# Altium schematic sheet Sheet2.SchDoc
size 420 x 297 mm; DocumentNumber: ЭАЕСН.464512.003Э3; SheetNumber: 2; SheetTotal: x; DocumentName: Sheet1.SCHDOC
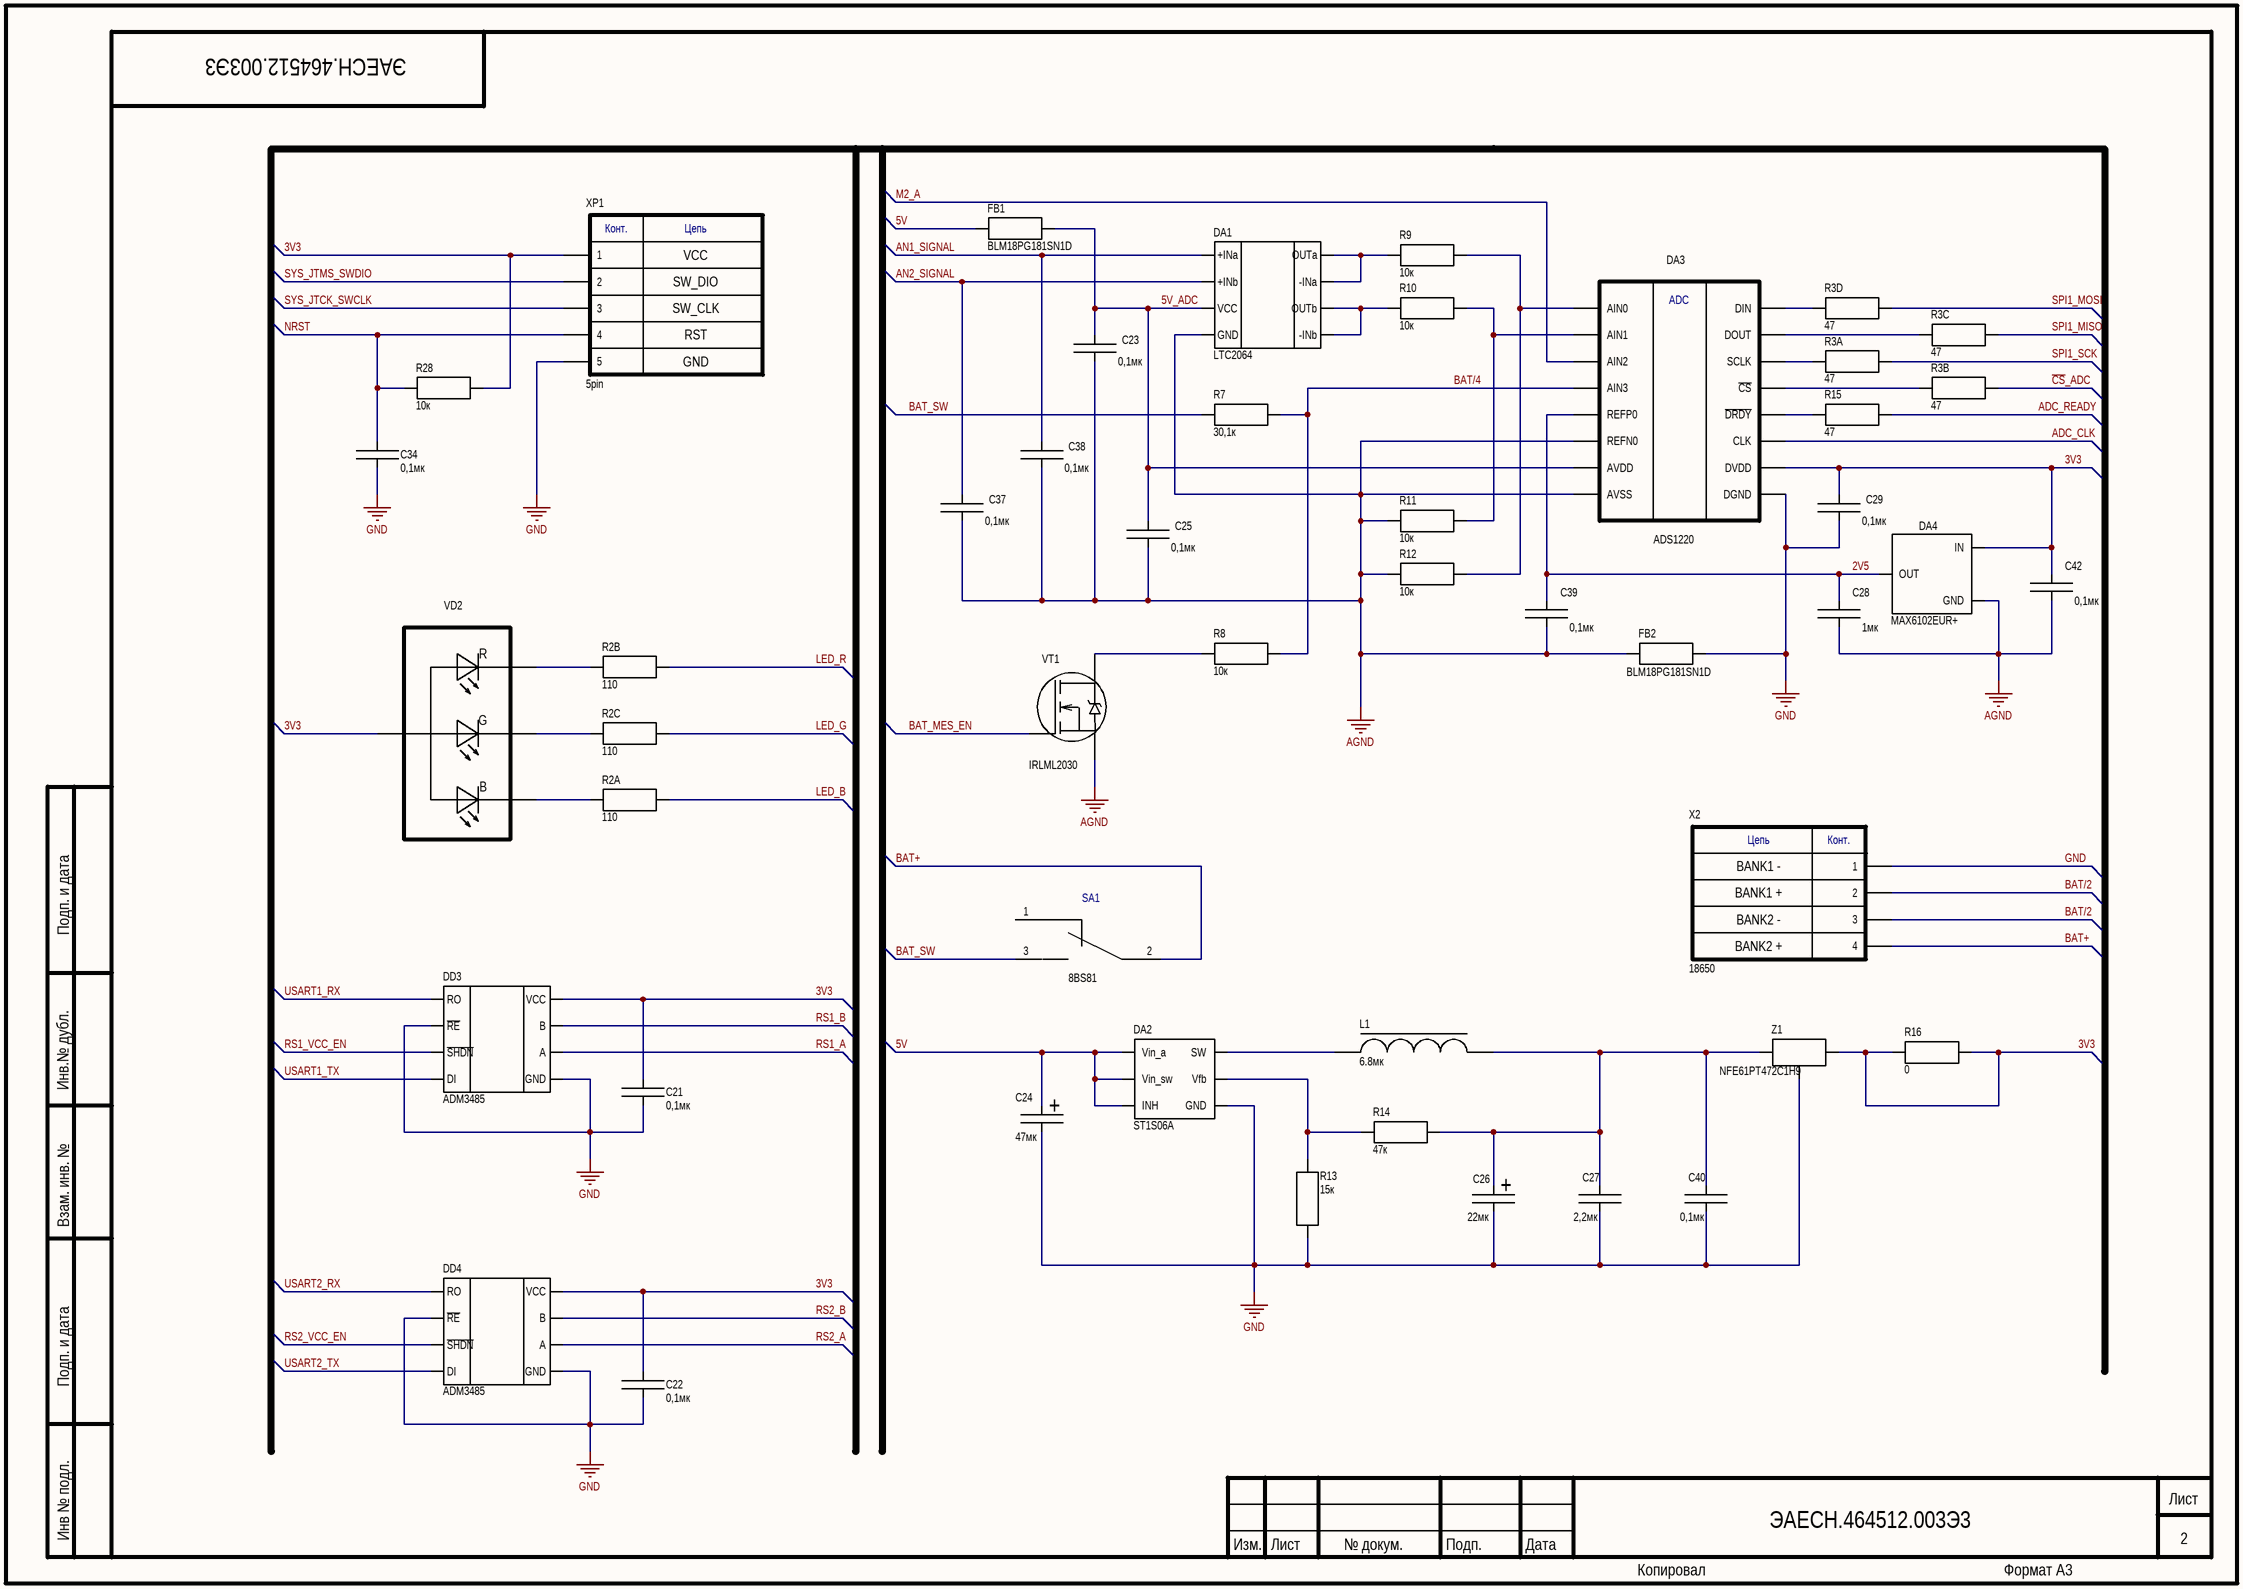
[diagram p0: Sheet2.SchDoc]

## Parts
C21  value 0,1мк  [С0603]  (hidden comment: C)
C22  value 0,1мк  [С0603]  (hidden comment: C)
C23  value 0,1мк  [С0603]  (hidden comment: C)
C24  value 47мк  [CASE B]  (hidden comment: C_el)
C25  value 0,1мк  [С0603]  (hidden comment: C)
C26  value 22мк  [Case A]  (hidden comment: C_el)
C27  value 2,2мк  [С0603]  (hidden comment: C)
C28  value 1мк  [С0603]  (hidden comment: C)
C29  value 0,1мк  [С0603]  (hidden comment: C)
C34  value 0,1мк  [С0603]  (hidden comment: C)
C37  value 0,1мк  [С0603]  (hidden comment: C)
C38  value 0,1мк  [С0603]  (hidden comment: C)
C39  value 0,1мк  [С0603]  (hidden comment: C)
C40  value 0,1мк  [С0603]  (hidden comment: C)
C42  value 0,1мк  [С0603]  (hidden comment: C)
DA1  LTC2064  [MSOP8]
DA2  ST1S06A  [DFN6]
DA3  ADS1220  [TSSOP-16]
DA4  MAX6102EUR+  [SOT-23]
DD3  ADM3485  [SOIC8]
DD4  ADM3485  [SOIC8]
FB1  BLM18PG181SN1D  [R0603]
FB2  BLM18PG181SN1D  [R0603]
L1  6.8мк  [Ind_6.5x6.5]
R2  value 110  [CAT16]  (hidden comment: RES_4)  (parts A,B,C of 4)
R3  value 47  [CAT16]  (hidden comment: RES_4)  (parts A,B,C,D of 4)
R7  value 30,1к  [R0603]  (hidden comment: R)
R8  value 10к  [R0603]  (hidden comment: R)
R9  value 10к  [R0603]  (hidden comment: R)
R10  value 10к  [R0603]  (hidden comment: R)
R11  value 10к  [R0603]  (hidden comment: R)
R12  value 10к  [R0603]  (hidden comment: R)
R13  value 15к  [R0603]  (hidden comment: R)
R14  value 47к  [R0603]  (hidden comment: R)
R15  value 47  [R0603]  (hidden comment: R)
R16  value 0  [R1206]  (hidden comment: R)
R28  value 10к  [R0603]  (hidden comment: R)
SA1  8BS81  [SMTS-102]
VD2  FYLS-3528RGBC  [LED_RGB]  (value not drawn)
VT1  IRLML2030  [SOT-23]
X2  18650  [18650_holder]
XP1  5pin  [PLS-5]
Z1  NFE61PT472C1H9  [NFE61P]

## Nets
AGND: C23.2 C25.2 C28.2 C37.2 C38.2 C39.2 C42.2 DA1.4(GND) DA3.5(AVSS) DA3.8(REFN0) DA4.3(GND) FB2.1 R11.2 R12.2 VT1.2(S)
GND: C21.2 C22.2 C24.2 C26.2 C27.2 C29.2 C34.2 C40.2 DA2.2(GND) DA3.4(DGND) DD3.2(~{RE}) DD3.5(GND) DD4.2(~{RE}) DD4.5(GND) FB2.2 R13.1 X2.1 XP1.5 Z1.3(GND)
2V5: C28.1 C39.1 DA3.9(REFP0) DA4.2(OUT)
3V3: C21.1 C22.1 C29.1 C42.1 DA3.13(DVDD) DA4.1(IN) DD3.8(VCC) DD4.8(VCC) R16.1 R16.2 R28.2 VD2.2 XP1.1 Z1.2
5V: C24.1 DA2.4(Vin_sw) DA2.5(Vin_a) DA2.6(INH) FB1.2
5V_ADC: C23.1 C25.1 DA1.8(VCC) DA3.12(AVDD) FB1.1
ADC_CLK: DA3.3(CLK)
ADC_READY: R15.2
AN1_SIGNAL: C38.1 DA1.3(+INa)
AN2_SIGNAL: C37.1 DA1.5(+INb)
BAT+: SA1.2 X2.4
BAT/2: X2.2 X2.3
BAT/4: DA3.6(AIN3) R7.2 R8.2
BAT_MES_EN: VT1.1(G)
BAT_SW: R7.1 SA1.3
~{CS}_ADC: R3.7
LED_B: R2.8
LED_G: R2.6
LED_R: R2.7
M2_A: DA3.7(AIN2)
NRST: C34.1 R28.1 XP1.4
RS1_A: DD3.6(A)
RS1_B: DD3.7(B)
RS1_VCC_EN: DD3.3(~{SHDN})
RS2_A: DD4.6(A)
RS2_B: DD4.7(B)
RS2_VCC_EN: DD4.3(~{SHDN})
SPI1_MISO: R3.6
SPI1_MOSI: R3.5
SPI1_SCK: R3.8
SYS_JTCK_SWCLK: XP1.3
SYS_JTMS_SWDIO: XP1.2
USART1_RX: DD3.1(RO)
USART1_TX: DD3.4(DI)
USART2_RX: DD4.1(RO)
USART2_TX: DD4.4(DI)
NetC26_1: C26.1 C27.1 C40.1 L1.1 R14.2 Z1.1
NetDA1_1: DA1.1(OUTa) DA1.2(-INa) R9.1
NetDA1_6: DA1.6(-INb) DA1.7(OUTb) R10.1
NetDA2_1: DA2.1(Vfb) R13.2 R14.1
NetDA2_3: DA2.3(SW) L1.2
NetDA3_1: DA3.1(SCLK) R3.1
NetDA3_2: DA3.2(~{CS}) R3.2
NetDA3_10: DA3.10(AIN1) R10.2 R11.1
NetDA3_11: DA3.11(AIN0) R9.2 R12.1
NetDA3_14: DA3.14(~{DRDY}) R15.1
NetDA3_15: DA3.15(DOUT) R3.3
NetDA3_16: DA3.16(DIN) R3.4
NetR2_1: R2.1 VD2.3
NetR2_2: R2.2 VD2.1
NetR2_3: R2.3 VD2.4
NetR8_1: R8.1 VT1.3(D)

Not connected (* = marked no-connect by the designer): SA1 1

## Notes on the sheet
- VCC
- SW_DIO
- SW_CLK
- RST
- GND
- Подп. и дата
- Инв.№ дубл.
- Взам. инв. №
- Инв № подл.
- Изм.
- Лист
- № докум.
- Подп.
- Дата
- Копировал
- Формат А3
- (in symbol 5pin) Конт.; Цепь
- (in symbol 18650_holder) Цепь; Конт.; BANK1 -; BANK1 +; BANK2 -; BANK2 +
- (in symbol ADC1220) ADC
- (in symbol C_el) +
- (in symbol LED_RGB) R; G; B

## Library data of the parts
DA3 = ADC1220
DD3 DD4 = MAX13487: RS485
FB1 FB2 = R: Value: 0
L1 = L
SA1 = Button
VD2 = LED_RGB
VT1 = N-channel
X2 = 18650_holder
Z1 = Filter